# EAGLE board TINRS - Wobbler (pico)sch (EAGLE 7.7.0)
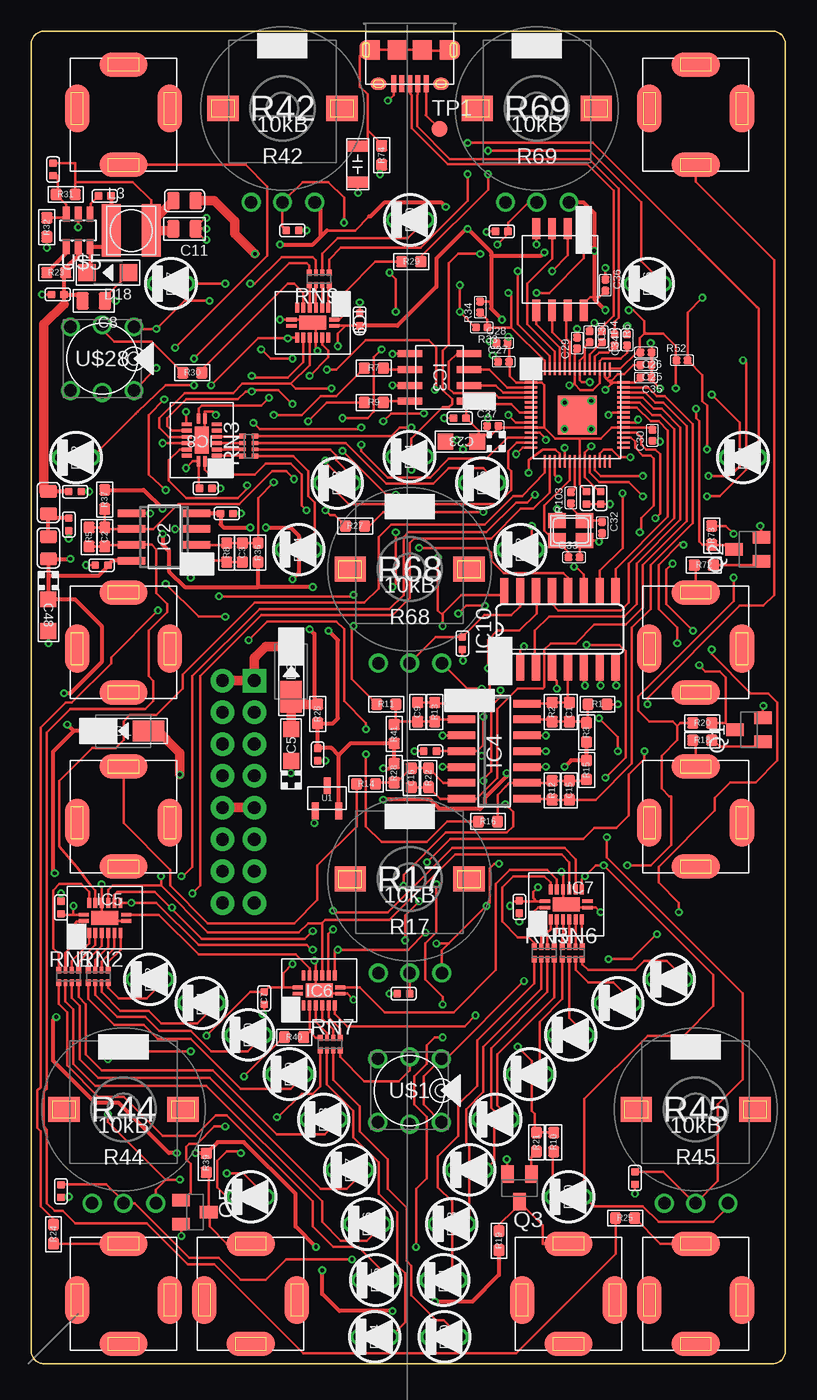
[diagram p5: board, top side]
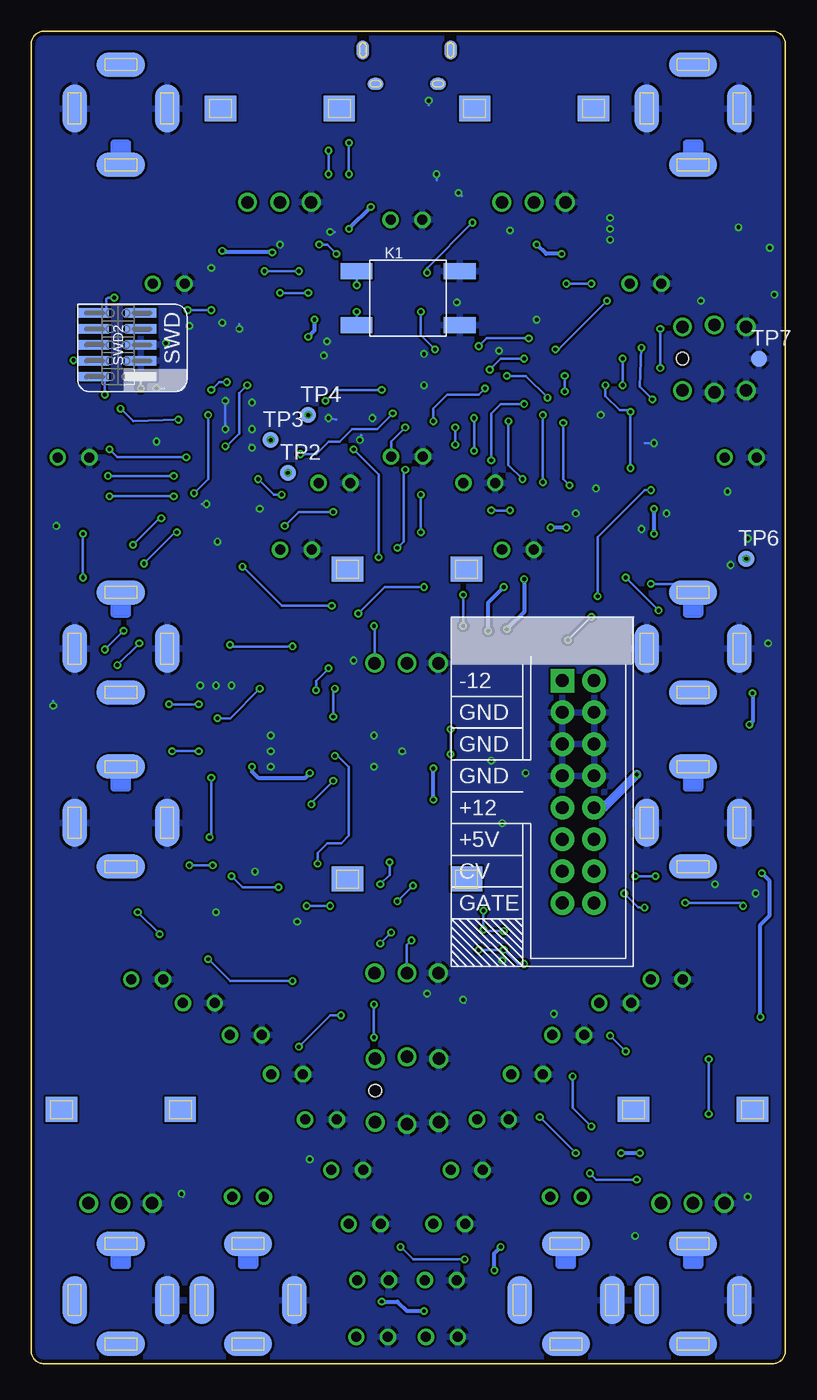
[diagram p6: board, bottom side, seen from below]

Size 60.25 x 106.5 mm. Coordinates in mm from the lower left corner, seen from the top.
Copper layers (1*16): Top 0.035mm / dielectric 1.5mm / Bottom 0.035mm
Design rules "dirt_cheap_dirty_boards.v1.1": minimum track width 6mil, minimum drill 12mil, track to track 6mil, track to pad 6mil, pad to pad 6mil, via to via 6mil, smd to smd 0mil, copper to edge 10mil, drill to drill 10mil, minimum pad ring 10mil, minimum via ring 6mil, stop-mask expansion 2mil, vias tented up to drill 25mil, thermal gap 10mil
Net classes: 0 default: width 0.203 mm, clearance 0.178 mm; 1 heavypower: width 0.305 mm; 2 mediumpower: width 0.254 mm; 3 groundplane: width 0.203 mm, clearance 0.203 mm; 4 returnground: width 0.356 mm; 5 reallyheav: width 0.762 mm

## Footprints (pad centres in the part's own frame; a part is rotated, then mirrored left to right if it is on the bottom)
C0603 = smd 0.889 x 0.889: 1 -0.762,0; 2 0.762,0
C0402 = smd 0.6 x 0.6: 1 -0.5,0; 2 0.5,0
CASE-A_3216 = smd 1.27 x 1.27: + -1.27,0; - 1.27,0
C0805 = smd 1.016 x 1.397: 1 -0.889,0; 2 0.889,0
C0402' = smd 0.635 x 0.635: 1 -0.445,0; 2 0.445,0
C3216 = smd 0.889 x 1.6: P$1 -1.448,0; P$2 1.448,0
DO-214AC = smd 2.5 x 1.7: 1 -2,0; 2 2,0
3MMLED = drill 0.8: + -1.27,0; - 1.27,0
SOD123 = smd 1.397 x 1.397: + -1.651,0; - 1.651,0
SO08 = smd 0.6 x 2.2: 1 -1.905,-2.6; 2 -0.635,-2.6; 3 0.635,-2.6; 4 1.905,-2.6; 5 1.905,2.6; 6 0.635,2.6; 7 -0.635,2.6; 8 -1.905,2.6
SOIC8-N_MC = smd 0.559 x 1.981: 1 -1.905,-2.362; 2 -0.635,-2.362; 3 0.635,-2.362; 4 1.905,-2.362; 5 1.905,2.362; 6 0.635,2.362; 7 -0.635,2.362; 8 -1.905,2.362
SO14 = smd 0.6 x 2.2: 1 -3.81,-2.6; 2 -2.54,-2.6; 3 -1.27,-2.6; 4 0,-2.6; 5 1.27,-2.6; 6 2.54,-2.6; 7 3.81,-2.6; 8 3.81,2.6; 9 2.54,2.6; 10 1.27,2.6; 11 0,2.6; 12 -1.27,2.6; 13 -2.54,2.6; 14 -3.81,2.6
QFN50P250X350X100-17N = smd 0.305 x 0.813: 1 -0.254,1.702; 8 -0.254,-1.702; 9 0.254,-1.702; 16 0.254,1.702 | smd 0.813 x 0.305: 2 -1.194,1.245; 3 -1.194,0.762; 4 -1.194,0.254; 5 -1.194,-0.254; 6 -1.194,-0.762; 7 -1.194,-1.245; 10 1.194,-1.245; 11 1.194,-0.762; 12 1.194,-0.254; 13 1.194,0.254; 14 1.194,0.762; 15 1.194,1.245 | smd 1.143 x 2.159: 17 0,0
SO16 = smd 0.66 x 2.032: 1 -4.445,-3.073; 2 -3.175,-3.073; 3 -1.905,-3.073; 4 -0.635,-3.073; 5 0.635,-3.073; 6 1.905,-3.073; 7 3.175,-3.073; 8 4.445,-3.073; 9 4.445,3.073; 10 3.175,3.073; 11 1.905,3.073; 12 0.635,3.073; 13 -0.635,3.073; 14 -1.905,3.073; 15 -3.175,3.073; 16 -4.445,3.073
C132563 = smd 0.4 x 1.35: 1 -1.3,4.15; 2 -0.65,4.15; 3 0,4.15; 4 0.65,4.15; 5 1.3,4.15 | smd 1.25 x 0.95 bottom: B@1 -2.5,4.15; B@3 2.5,4.15 | smd 1.25 x 0.95: B@2 -2.5,4.15; B@4 2.5,4.15 | smd 1.1 x 1.55: B@5 2.95,1.45; B@8 -2.95,1.45 | smd 1.5 x 1.55: B@6 1,1.45; B@7 -1,1.45 | smd 1 x 1.55: B@9 -3.5,1.45; B@12 3.5,1.45 | smd 1 x 1.55 bottom: B@10 -3.5,1.45; B@11 3.5,1.45
POWER_16_SHROUDED = drill 1.016 pad 1.88 square: 1 -8.89,-1.27 | drill 1.016 pad 1.88: 2 -8.89,1.27; 3 -6.35,-1.27; 4 -6.35,1.27; 5 -3.81,-1.27; 6 -3.81,1.27; 7 -1.27,-1.27; 8 -1.27,1.27; 9 1.27,-1.27; 10 1.27,1.27; 11 3.81,-1.27; 12 3.81,1.27; 13 6.35,-1.27; 14 6.35,1.27; 15 8.89,-1.27; 16 8.89,1.27
3.5MM-JACK-SWITCH-13MM-NOHOLES-TESTPAD = smd 1.95 x 3.85 bottom: RING_B@1 -3.7,0; SWITCH_B@1 3.7,0 | smd 1.95 x 3.85: RING_T@3 -3.7,0; SWITCH_T@3 3.7,0 | smd 3.85 x 1.95 bottom: SECOND_B@1 0,-3.5; TIP_B@1 0,4.5 | smd 3.85 x 1.95: SECOND_T@3 0,-3.5; TIP_T@3 0,4.5
4P-SMD-6.0X6.0X5.0H = smd 2.54 x 1.27: 0A -4.129,2.159; 0B 4.129,2.159; 1A -4.129,-2.159; 1B 4.129,-2.159
L0805 = smd 1.016 x 1.397: 1 -0.889,0; 2 0.889,0
L0420 = smd 1.5 x 4.2: 1 -1.6,0; 2 1.6,0
SOT23-BEC = smd 1 x 1.4: B -0.95,-1.1; C 0,1.1; E 0.95,-1.1
NX3225 = smd 1.4 x 1.2: 1 -1.1,-0.8; 2 1.1,-0.8; 3 1.1,0.8; 4 -1.1,0.8
R0603 = smd 0.889 x 0.889: 1 -0.762,0; 2 0.762,0
R0402 = smd 0.635 x 0.635: 1 -0.445,0; 2 0.445,0
ALPS_POT_SQUAREHOLES = drill 1: P$1 -2.5,-7.5; P$2 0,-7.5; P$3 2.58,-7.5 | smd 2.5 x 2: P$4 -4.75,0; P$5 4.75,0 | smd 2.5 x 2 bottom: P$6 -4.75,0; P$7 4.75,0
4X0402ARV341 = smd 0.4 x 0.5: 1 -0.8,-0.5; 4 0.8,-0.5; 5 0.8,0.5; 8 -0.8,0.5 | smd 0.3 x 0.5: 2 -0.25,-0.5; 3 0.25,-0.5; 6 0.25,0.5; 7 -0.25,0.5
M50-3600542 = smd 0.75 x 2.5: 1 -2.54,-1.81; 2 -2.54,2; 3 -1.27,-1.81; 4 -1.27,2; 5 0,-1.81; 6 0,2; 7 1.27,-1.81; 8 1.27,2; 9 2.54,-1.81; 10 2.54,2
B1,27 = smd 1.27 x 1.27: TP 0,0
SOT95P237X112-3N = smd 1.321 x 0.559: 1 -1.016,0.94; 2 -1.016,-0.94; 3 1.016,0
PB6149L = drill 1: 1 2.54,2.54; 2 2.54,-2.54; 3 -2.54,2.54; 4 -2.54,-2.54; LEDNEG 0,-2.7; LEDPOS 0,2.7 | hole 1: 2.54,0
QFN-56 = smd 3.1 x 3.1: GND 0,0 | smd 1 x 0.18: P$1 -3.7,2.6; P$2 -3.7,2.2; P$3 -3.7,1.8; P$4 -3.7,1.4; P$5 -3.7,1; P$6 -3.7,0.6; P$7 -3.7,0.2; P$8 -3.7,-0.2; P$9 -3.7,-0.6; P$10 -3.7,-1; P$11 -3.7,-1.4; P$12 -3.7,-1.8; P$13 -3.7,-2.2; P$14 -3.7,-2.6; P$29 3.7,-2.6; P$30 3.7,-2.2; P$31 3.7,-1.8; P$32 3.7,-1.4; P$33 3.7,-1; P$34 3.7,-0.6; P$35 3.7,-0.2; P$36 3.7,0.2; P$37 3.7,0.6; P$38 3.7,1; P$39 3.7,1.4; P$40 3.7,1.8; P$41 3.7,2.2; P$42 3.7,2.6 | smd 0.18 x 1: P$15 -2.6,-3.7; P$16 -2.2,-3.7; P$17 -1.8,-3.7; P$18 -1.4,-3.7; P$19 -1,-3.7; P$20 -0.6,-3.7; P$21 -0.2,-3.7; P$22 0.2,-3.7; P$23 0.6,-3.7; P$24 1,-3.7; P$25 1.4,-3.7; P$26 1.8,-3.7; P$27 2.2,-3.7; P$28 2.6,-3.7; P$43 2.6,3.7; P$44 2.2,3.7; P$45 1.8,3.7; P$46 1.4,3.7; P$47 1,3.7; P$48 0.6,3.7; P$49 0.2,3.7; P$50 -0.2,3.7; P$51 -0.6,3.7; P$52 -1,3.7; P$53 -1.4,3.7; P$54 -1.8,3.7; P$55 -2.2,3.7; P$56 -2.6,3.7
SOT23-6 = smd 0.55 x 1.2: 1 -0.95,-1.3; 2 0,-1.3; 3 0.95,-1.3; 4 0.95,1.3; 5 0.003,1.3; 6 -0.95,1.3
SOIC-8 = smd 0.635 x 1.7: 1 -1.905,-3.27; 2 -0.635,-3.27; 3 0.635,-3.27; 4 1.905,-3.27; 5 1.905,3.27; 6 0.635,3.27; 7 -0.635,3.27; 8 -1.905,3.27

## Placement (x,y rotation side)
C1  3.3nF  [C0603]  42.99,52.08 90 top
C2  3.3nF C0G  [C0603]  5.87,66.08 270 top
C3  3.3nF COG  [C0603]  16.87,64.83 270 top
C4  100nF  [C0402]  34.45,57.57 270 top
C5  10uF  [CASE-A_3216]  20.76,49.44 90 top
C6  100nF  [C0402]  22.89,48.69 90 top
C7  100nF  [C0402]  18.61,29.2 90 top
C8  10u  [C0805]  5,84.95 180 top
C9  3.3nF  [C0603]  30.87,52.08 90 top
C10  100nF  [C0402]  37.6,90.51 180 top
C11  22u  [C0805]  12.25,90.7 180 top
C14  100nF  [C0402]  2.37,36.45 270 top
C15  3.3nF  [C0603]  42.99,45.83 270 top
C16  3.3nF  [C0603]  30.37,46.83 270 top
C17  100nF  [C0402]  31.87,48.95 180 top
C18  100nF  [C0402]  5.62,63.83 0 top
C19  100nF  [C0402]  15.62,67.95 180 top
C20  100nF  [C0402]  39,36.5 90 top
C21  100nF  [C0402]  20.87,90.58 0 top
C22  100nF  [C0402]  13.94,69.97 180 top
C23  10uF  [CASE-A_3216]  34.37,73.7 180 top
C24  100nF  [C0402]  29.75,29.58 180 top
C25  100n  [C0402']  49.12,79.83 180 top
C26  100n  [C0402']  49.12,80.83 180 top
C27  100n  [C0402']  37.74,80.08 0 top
C28  100n  [C0402']  37.62,81.58 0 top
C29  100n  [C0402']  43.62,81.58 90 top
C30  100n  [C0402']  49.62,74.2 90 top
C31  100n  [C0402']  44.62,82.08 270 top
C32  27p  [C0402']  45.62,66.83 270 top
C33  27p  [C0402']  43.37,64.45 0 top
C34  1u  [C0402']  47.62,81.83 90 top
C35  100n  [C0402']  49.12,78.83 180 top
C36  100n  [C0402']  45.87,86.2 270 top
C37  100n  [C0402']  36.87,74.95 0 top
C38  100nF  [C0402]  26.25,83.45 270 top
C39  4.7n 100v  [C3216]  26.08,95.88 90 top
C40  100nF  [C0402]  48.24,14.83 270 top
C41  100nF  [C0402]  2.37,13.78 270 top
C42  10n  [C0402]  3,67.08 90 top
C43  100nF  [C0402]  2.12,85.45 0 top
C44  100nF  [C0402]  3.5,69.7 180 top
C45  100nF  [C0402]  5.87,93.33 180 top
C46  33p  [C0402]  1.75,95.45 270 top
C48  10uF  [CASE-A_3216]  1.37,59.83 270 top
C74  100n  [C0402]  44.37,69.2 90 top
C99  100n  [C0402]  45.49,69.2 270 top
C100  1u  [C0402]  34.24,75.58 180 top
D1  MRA4004T3G  [DO-214AC]  7.36,50.56 180 top
D2  MRA4004T3G  [DO-214AC]  20.76,55.31 90 top
D3  yellow  [3MMLED]  17.53,13.33 180 top
D4  yellow  [3MMLED]  35.01,15.48 180 top
D5  yellow  [3MMLED]  37.1,19.51 180 top
D6  yellow  [3MMLED]  39.82,23.14 180 top
D7  yellow  [3MMLED]  43.11,26.27 180 top
D8  yellow  [3MMLED]  46.86,28.82 180 top
D9  yellow  [3MMLED]  50.99,30.71 180 top
D10  yellow  [3MMLED]  33.02,2.14 180 top
D11  yellow  [3MMLED]  32.94,6.67 180 top
D12  yellow  [3MMLED]  39.09,65.06 180 top
D13  yellow  [3MMLED]  24.44,70.39 180 top
D14  yellow  [3MMLED]  21.37,65.06 180 top
D16  yellow  [3MMLED]  49.27,86.33 180 top
D17  yellow  [3MMLED]  11.17,86.33 180 top
D18  schottky  [SOD123]  6.12,87.2 180 top
D20  yellow  [3MMLED]  30.27,91.43 180 top
D21  yellow  [3MMLED]  56.87,72.43 180 top
D22  yellow  [3MMLED]  3.57,72.43 180 top
D24  yellow  [3MMLED]  27.44,2.14 180 top
D25  yellow  [3MMLED]  27.52,6.67 180 top
D26  yellow  [3MMLED]  26.85,11.16 180 top
D27  yellow  [3MMLED]  25.45,15.48 180 top
D28  yellow  [3MMLED]  23.36,19.51 180 top
D29  yellow  [3MMLED]  20.64,23.14 180 top
D30  yellow  [3MMLED]  17.35,26.27 180 top
D31  yellow  [3MMLED]  13.6,28.82 180 top
D32  yellow  [3MMLED]  9.47,30.71 180 top
D33  yellow  [3MMLED]  33.61,11.16 180 top
D34  yellow  [3MMLED]  30.23,72.5 180 top
D35  yellow  [3MMLED]  36.02,70.39 180 top
D40  yellow  [3MMLED]  42.93,13.33 180 top
IC2  TL072  [SO08]  10.62,66.08 90 top
IC3  MCP4822-E/SN  [SOIC8-N_MC]  32.62,78.83 90 top
IC4  MCP6004  [SO14]  36.99,48.95 270 top
IC5  74HC595BQ  [QFN50P250X350X100-17N]  5.88,35.63 90 top
IC6  74HC595BQ  [QFN50P250X350X100-17N]  23,29.83 90 top
IC7  74HC595BQ  [QFN50P250X350X100-17N]  42.74,36.7 90 top
IC8  74HC595BQ  [QFN50P250X350X100-17N]  13.62,73.83 180 top
IC9  74HC595BQ  [QFN50P250X350X100-17N]  22.5,83.2 270 top
IC10  4052D  [SO16]  42.24,58.7 0 top
J1  MICRO-USB-5P  [C132563]  30.25,106.45 180 top
J14  POWERSHROUDED  [POWER_16_SHROUDED]  16.55,45.71 270 bottom
JACK1  [3.5MM-JACK-SWITCH-13MM-NOHOLES-TESTPAD]  7.37,43.23 0 top
JACK2  [3.5MM-JACK-SWITCH-13MM-NOHOLES-TESTPAD]  7.37,57.15 0 top
JACK3  [3.5MM-JACK-SWITCH-13MM-NOHOLES-TESTPAD]  53.09,100.33 180 top
JACK4  [3.5MM-JACK-SWITCH-13MM-NOHOLES-TESTPAD]  53.09,43.23 0 top
JACK5  [3.5MM-JACK-SWITCH-13MM-NOHOLES-TESTPAD]  53.09,57.15 0 top
JACK6  [3.5MM-JACK-SWITCH-13MM-NOHOLES-TESTPAD]  7.37,100.33 180 top
JACK7  [3.5MM-JACK-SWITCH-13MM-NOHOLES-TESTPAD]  7.37,5.08 0 top
JACK8  [3.5MM-JACK-SWITCH-13MM-NOHOLES-TESTPAD]  53.09,5.08 0 top
JACK9  [3.5MM-JACK-SWITCH-13MM-NOHOLES-TESTPAD]  17.53,5.08 0 top
JACK10  [3.5MM-JACK-SWITCH-13MM-NOHOLES-TESTPAD]  42.93,5.08 0 top
K1  BUTTON-4P-3100010P1  [4P-SMD-6.0X6.0X5.0H]  30.14,85.16 0 bottom
L1  0.1uH C76737  [L0805]  1.37,65.2 90 top
L2  0.1uH C76737  [L0805]  1.37,68.83 90 top
L3  4.7uH  [L0420]  8,90.58 0 top
L4  0.1uH C76737  [L0805]  12.25,92.95 0 top
OUTLINE  EURORACK_PCB12HP  [EURORACK12HPPCB]  -0.25,0 0 top
Q1  MMBT3904  [SOT23-BEC]  57.35,50.66 90 top
Q2  MMBT3904  [SOT23-BEC]  57.24,65.09 90 top
Q3  MMBT3904  [SOT23-BEC]  39,14.04 180 top
Q4  12mhz  [NX3225]  43.12,66.58 180 top
Q5  MMBT3904  [SOT23-BEC]  13.08,12.11 270 top
R1  100k  [R0603]  45.24,52.7 0 top
R2  33k  [R0603]  41.62,52.08 270 top
R3  100k  [R0603]  44.37,50.45 270 top
R4  27  [R0402]  45.62,82.08 270 top
R5  187k 0.1%  [R0603]  4.62,66.08 90 top
R6  27  [R0402]  46.62,81.83 270 top
R7  38.3k 0.1%  [R0603]  27.37,79.58 0 top
R8  187k 0.1%  [R0603]  15.62,64.83 90 top
R9  38.3k 0.1%  [R0603]  27.37,76.83 0 top
R10  56  [R0603]  41.74,17.7 90 top
R11  100k  [R0603]  28.37,52.7 180 top
R12  33k  [R0603]  41.62,45.83 90 top
R13  33k  [R0603]  32.24,52.08 270 top
R14  100k  [R0603]  26.75,46.33 180 top
R15  100k  [R0603]  44.37,47.45 90 top
R16  100k  [R0603]  36.49,43.33 180 top
R17  10kB  [ALPS_POT_SQUAREHOLES]  30.23,38.73 0 top
R18  100k  [R0603]  53.62,49.83 0 top
R19  10k  [R0603]  37.37,9.83 270 top
R20  10k  [R0603]  53.62,51.2 180 top
R21  100k  [R0603]  40.37,17.7 270 top
R22  33k  [R0603]  31.75,46.83 90 top
R23  100k  [R0603]  2,87.2 0 top
R24  100  [R0603]  1.78,10.35 90 top
R25  100  [R0603]  47.45,11.64 180 top
R26  10k  [R0603]  22.88,51.94 270 top
R27  56  [R0603]  25.87,66.95 180 top
R28  100k  [R0603]  29,47.2 90 top
R29  56  [R0603]  30.37,88.08 180 top
R30  56  [R0603]  12.87,79.2 0 top
R31  49.9k  [R0603]  2.75,93.45 180 top
R32  16.2k  [R0603]  1.25,90.83 270 top
R33  1k  [R0402]  35.99,82.83 180 top
R34  10k DNP  [R0402]  35.87,84.45 90 top
R36  187k 0.1%  [R0603]  18.12,64.83 270 top
R37  187k 0.1%  [R0603]  5.87,69.08 90 top
R39  10k  [R0603]  13.99,16.05 90 top
R40  100k  [R0603]  21,26.08 180 top
R41  100k  [R0603]  29,50.33 270 top
R42  10kB  [ALPS_POT_SQUAREHOLES]  20.07,100.33 0 top
R44  10kB  [ALPS_POT_SQUAREHOLES]  7.37,20.32 0 top
R45  10kB  [ALPS_POT_SQUAREHOLES]  53.09,20.32 0 top
R52  10k  [R0402]  51.99,80.2 0 top
R68  10kB  [ALPS_POT_SQUAREHOLES]  30.23,63.5 0 top
R69  10kB  [ALPS_POT_SQUAREHOLES]  40.39,100.33 0 top
R72  100k  [R0603]  53.74,63.83 0 top
R73  10k  [R0603]  54.37,66.2 90 top
R74  1M  [R0603]  28,96.58 90 top
R103  1k  [R0402]  43.12,69.2 90 top
RN1  56  [4X0402ARV341]  2.98,30.96 180 top
RN2  56  [4X0402ARV341]  5.37,30.96 180 top
RN3  56  [4X0402ARV341]  17.37,73.33 270 top
RN5  56  [4X0402ARV341]  40.99,32.83 180 top
RN6  56  [4X0402ARV341]  43.24,32.83 180 top
RN7  56  [4X0402ARV341]  23.88,25.55 180 top
RN9  56  [4X0402ARV341]  23,86.7 0 top
SWD2  CORTEX_SWD  [M50-3600542]  53.3,81.44 90 bottom
TP1  PTR1B1,27  [B1,27]  32.62,98.7 0 top
TP2  PTR1B1,27  [B1,27]  39.74,71.2 0 bottom
TP3  PTR1B1,27  [B1,27]  41.12,73.83 0 bottom
TP4  PTR1B1,27  [B1,27]  38.12,75.83 0 bottom
TP6  PTR1B1,27  [B1,27]  3.12,64.33 0 bottom
TP7  PTR1B1,27  [B1,27]  2.12,80.33 0 bottom
U1  LM4040DIM3-5.0  [SOT95P237X112-3N]  23.64,45.19 90 top
U$1  SWITCH_W_LED_PB6149L-X-102YELLOW  [PB6149L]  30.23,21.83 0 top
U$2  RP2040  [QFN-56]  43.62,75.83 0 top
U$5  BL9342  [SOT23-6]  3.75,90.58 180 top
U$25  W25Q256JVEIQTR  [SOIC-8]  42.24,87.45 180 top
U$28  SWITCH_W_LED_PB6149L-X-102YELLOW  [PB6149L]  5.67,80.33 0 top

## Tracks (layer width: path | path; a pad name or v marks a point on that pad's centre or on a via)
1.1V  (via drill 0.3)
  Top 0.203: C34.1 47.62,80.83 47.12,80.33 45.62,80.33 45.42,80.13 U$2.P$45 45.42,78.38 44.87,77.83 43.87,77.83 43.42,78.28 43.42,78.38 | C29.1 43.42,80.94 U$2.P$50 43.42,78.62 43.42,78.38 | C99.1 45.37,69.7 44.22,70.85 U$2.P$23 44.22,72.81 v44.74,73.33 | v42.99,78.2 43.24,78.2 43.42,78.38
  Bottom 0.203: v44.74,73.33 44.62,73.33 43.62,74.33 43.62,77.58 v42.99,78.2
3.3V  (via drill 0.3)
  Top 0.203: U$2.P$48 44.22,80.58 | 44.22,80.58 44.22,81.23 C31.2 | 44.22,80.58 43.82,80.18 U$2.P$49 43.82,78.63 43.99,78.45 v44.62,78.45 | U$2.P$44 45.82,78.88 45.99,78.7 | 45.99,78.7 46.12,78.58 | 46.12,78.58 46.37,78.58 46.87,79.08 47.37,79.08 48.12,79.83 C25.2 | C35.2 48.28,78.43 U$2.P$42 46.27,78.43 | 46.27,78.43 46.12,78.58 | 45.99,78.7 46.22,78.93 U$2.P$43 47.07,79.53 48.37,80.83 C26.2 48.62,80.88 48.62,81.95 48.99,82.33 49.12,82.33 | v45.87,77.83 46.37,78.33 46.27,78.43 | C30.2 49.49,74.83 U$2.P$33 46.37,74.83 45.49,73.95 43.74,73.95 | C14.2 2.44,35.88 IC5.16 3.44,35.88 3.37,35.95 v3.37,36.58 | v51.49,77.95 51.49,80.26 | 49.12,82.33 50.49,82.33 51.49,81.33 51.49,80.26 | C22.2 13.37,70.04 IC8.16 12.92,72.13 v12.37,71.58 | IC5.10 7.13,36.84 7.87,36.83 v8,36.83 10,36.83 13.37,33.45 22,33.45 22.37,33.08 v22.5,33.08 | C74.2 43.82,70.25 U$2.P$22 43.82,73.88 43.74,73.95 | v40.49,38.08 40.12,37.7 40.12,37.2 40.37,36.96 IC7.16 39.04,36.96 C20.2 38.95,36.95 38.58,36.95 v38.24,36.58 | IC7.10 43.99,38.7 v44.24,38.95 45.12,39.83 v45.74,39.83 54.49,31.08 54.49,28.58 52.12,26.2 49.24,26.2 44.2,21.16 D40.+ 44.95,12.58 48.87,12.58 50.12,11.33 54.49,11.33 55.67,12.5 R45.P$3 | 44.99,85.26 44.68,85.26 44.24,84.83 44.24,84.28 U$25.8 | v47.74,84.2 48.12,84.2 48.99,83.33 48.99,82.45 49.12,82.33 | IC6.10 24.24,33.08 v24.5,33.08 30.12,33.08 v31.5,34.45 | IC3.1 34.74,76.69 C100.1 35.74,74.58 35.74,73.97 C23.+ | C23.+ 36.27,74.2 36.74,74.2 37.31,74.78 C37.2 37.69,74.83 U$2.P$10 40.99,74.83 | C28.2 38.19,81.45 C27.2 38.24,80.03 38.24,78.95 38.77,78.43 U$2.P$1 40.77,78.43 40.99,78.2 40.99,74.83
  Top 0.203: v20.87,31.95 20.12,31.2 20.12,30.08 IC6.16 18.99,30.08 C7.2 17.5,29.7 v14,26.2 | R17.P$3 32.81,33.02 33.37,33.58 | 33.37,33.58 v36.37,36.58 36.62,36.83 36.62,39.58 36.99,39.95 v37.37,39.95 | IC9.16 25.12,82.95 | 25.12,82.95 C38.2 | R44.P$3 9.95,13.91 10.75,14.7 | 10.75,14.7 v11.87,14.7 | v15.62,15.2 16.93,15.2 D3.+ | v12.37,76.08 12.37,75.13 IC8.10 | 44.99,85.26 44.99,85.2 | 44.99,85.26 45.37,85.26 C36.2 | 51.49,80.26 R52.1 | v32.37,33.58 33.37,33.58 | IC9.10 20.55,82.01 v20.5,81.95 18.12,81.95 v14.37,78.2 | v24.5,81.33 24.5,82.33 25.12,82.95 | R20.2 51.87,51.2 51.62,50.95 | v47.62,39.83 49.49,39.83 51.12,41.45 51.12,45.33 50.99,45.33 50.37,45.95 50.37,48.58 51.62,49.83 51.62,50.95 | v32.87,58.95 32.87,59.83 | 32.87,59.83 32.87,59.95 34.37,61.45 37.48,61.45 IC10.16 | C17.1 IC4.4 35.62,48.95 | 35.62,48.95 36.12,49.45 v36.12,51.7 | v35.99,53.95 34.85,53.95 R68.P$3 | 40.99,74.83 41.87,73.95 43.74,73.95 | R73.2 55.48,66.97 v56.12,66.33 | v56.12,62.83 56.12,60.95 48.49,53.33 48.49,52.2 49.37,51.33 51.24,51.33 51.62,50.95 | C23.+ 35.24,73.83 v34.49,73.08 | v32.49,64.45 32.49,60.2 32.87,59.83 | v12.75,24.95 6.75,24.95 v6.12,24.33 | v6.12,19.95 6.12,19.33 10.75,14.7 | 23.62,90.58 25.87,90.58 27,91.7 | 35.62,48.95 v35.99,48.58 | R34.2 36.55,84.9 36.74,84.7
  Top 0.305: 18.11,88.69 v17.87,88.7 | v19.87,89.45 22.5,89.45 23.12,90.08 | 23.12,90.08 23.12,92.36 R42.P$3 | 23.12,90.08 23.62,90.58 | 27,91.7 27.12,91.7 28.25,92.83 32.74,92.83 v33.12,92.45 | C38.2 29.25,82.95 32.37,86.08 32.37,88.33 34.74,90.7 v34.87,90.7 36.74,88.83 36.74,88.58 | 36.74,88.58 36.74,84.7 36.74,84.33 v37.62,83.45 | v38.12,82.08 38.12,81.63 C28.2 | 36.74,88.58 40.74,88.58 v40.99,88.83 | v44.99,88.95 44.99,89.33 | R69.P$3 44.12,92.83 44.99,91.95 v44.99,88.95 | v44.99,88.95 44.99,85.2 44.99,85.08 v45.87,84.2
  Top 0.762: L4.2 14.62,92.95 16.25,91.33 16.25,90.33 v17.87,88.7
  Bottom 0.203: v44.62,78.45 45.24,78.45 v45.87,77.83 | SWD2.1 v51.49,77.95 | v40.49,38.08 43.37,38.08 v44.24,38.95 | v45.87,84.2 v47.74,84.2 | v24.5,33.08 v22.5,33.08 21.37,31.95 v20.87,31.95 | v8,36.83 3.62,36.83 v3.37,36.58 | v36.37,36.58 v38.24,36.58 | v11.87,14.7 15.12,14.7 v15.62,15.2 | v12.37,71.58 v12.37,76.08 12.5,76.2 13.25,76.2 14.37,77.33 v14.37,78.2 | v31.5,34.45 v32.37,33.58 | v20.5,81.95 23.87,81.95 v24.5,81.33 | v47.62,39.83 v45.74,39.83 | R68.P$3 32.81,58.89 v32.87,58.95 | v36.12,51.7 36.12,53.83 v35.99,53.95 | v56.12,66.33 v56.12,62.83 | v34.49,73.08 32.49,71.08 v32.49,64.45 | v14,26.2 v12.75,24.95 | v6.12,24.33 v6.12,19.95 | v35.99,48.58 35.74,48.58 34.87,47.7 34.87,42.2 35.49,41.58 36.62,41.58 37.37,40.83 v37.37,39.95
  Bottom 0.305: v17.87,88.7 19.12,88.7 v19.87,89.45 | v33.12,92.45 v34.87,90.7 | v37.62,83.45 37.62,82.58 v38.12,82.08 | v40.99,88.83 44.87,88.83 v44.99,88.95
12V  (via drill 0.3)
  Top 0.305: IC2.8 6.46,64.17 C18.2 6.12,63.7 5.37,62.95 1.37,62.95 | 1.37,62.95 L1.1 3.11,64.32 TP6.TP | 1.37,62.95 C48.+ 3.48,61.1 5.62,58.95 5.62,56.08 3.12,53.58 v2.62,53.58 | v32.24,4.95 35.24,4.95 37.37,7.08 R19.2 | v28.87,4.2 24.62,4.2 23.25,5.58 v23.25,7.45 | v22.75,9.33 21.12,10.95 21.12,13.58 17,17.7 14.88,17.7 R39.2 13.14,16.81 v13.12,16.83 | D1.2 3.39,50.56 | v2.87,51.08 3.39,50.56 | v11.62,16.83 11,16.83 7,20.83 5.12,20.83 1.75,24.2 1.75,27.45 v2,27.7 | v1.87,39.2 1.75,39.33 1.75,48.92 3.39,50.56
  Bottom 0.305: v32.24,4.95 31,4.95 30.25,4.2 v28.87,4.2 | v23.25,7.45 23.25,8.83 v22.75,9.33 | v2.62,53.58 2.62,51.33 v2.87,51.08 | v13.12,16.83 v11.62,16.83 | v2,27.7 2,35.08 1.25,35.83 1.25,38.58 v1.87,39.2
  other vias: 3.12,64.33
-12V  (via drill 0.3)
  Top 0.305: IC2.4 15.09,67.98 C19.2 15.12,67.08 15.37,66.83 v17.5,66.83 | v18.75,66.83 20.75,66.83 21.37,66.2 21.37,63.2 v20.87,62.7 | v22.25,58.7 22.62,58.33 22.62,52.96 R26.1
  Top 0.762: C5.- D2.1 21.37,52.7 R26.1
  Bottom 0.305: v17.5,66.83 v18.75,66.83 | v20.87,62.7 20.87,60.08 v22.25,58.7
ADC0
  Top 0.203: U$2.P$38 48.62,76.83 49.62,75.83 50.24,75.83 51.37,74.7 51.37,67.58 47.74,63.95 47.74,60.83 47.12,60.2 42.12,60.2 41.61,60.71 IC10.13
ADC1
  Top 0.203: U$2.P$39 48.84,77.23 49.74,76.33 50.37,76.33 51.87,74.83 51.87,67.45 48.37,63.95 48.37,60.7 47.37,59.7 41.37,59.7 40.24,58.58 40.24,55.73 IC10.3
ADC_FREQ
  Top 0.203: U$2.P$40 49.07,77.63 49.87,76.83 50.49,76.83 52.37,74.95 52.37,67.33 48.87,63.83 48.87,60.45 47.49,59.08 44.99,59.08 43.49,57.58 41.49,57.58 40.99,57.08 40.99,54.08 40.87,53.95 38.87,53.95 37.24,52.33 37.24,46.83 35.56,45.14 IC4.7 32.67,45.14 R22.1 C16.2
ADC_MOD
  Top 0.203: IC4.14 41.54,52.77 R2.1 C1.2 42.88,52.96 IC10.5
ADC_NORMAL  (via drill 0.3)
  Top 0.203: C41.1 2.41,14.33 6,14.33 7.37,12.95 R44.P$2 8.26,12.82 12.62,8.45 15,8.45 16.75,6.7 18.75,6.7 20.37,8.33 v25.62,8.33 | v30.75,9.33 30.75,13.95 31.62,14.83 31.62,19.7 30.62,20.7 30.62,22.95 31.62,23.95 31.62,25.45 32.24,26.08 v32.87,26.08 | v48.99,48.95 48.99,48.33 47.74,47.08 47.74,43.83 46.74,42.83 44.99,42.83 44.12,41.95 33.49,41.95 v31.62,40.08 | v32.37,38.33 32.37,34.45 31.5,33.58 31.5,30.7 32.87,29.33 v32.87,28.7 | v45.37,51.58 46.87,50.08 v46.87,48.95 | v41.99,53.95 41.99,54.58 41.74,54.83 41.74,55.5 IC10.4
  Bottom 0.203: v25.62,8.33 29.75,8.33 v30.75,9.33 | v46.87,48.95 v48.99,48.95 | v31.62,40.08 31.62,39.08 v32.37,38.33 | v32.87,28.7 v32.87,26.08 | v45.37,51.58 44.37,51.58 v41.99,53.95
ADC_PHASE
  Top 0.203: C9.2 R13.1 32.32,52.77 IC4.1 36.18,52.77 36.62,53.2 36.62,54.33 37.74,55.45 37.74,55.58 37.75,55.58 IC10.1
ADC_PHASED  (via drill 0.3)
  Top 0.203: C40.1 50.49,15.33 53,12.82 R45.P$2 54.87,14.6 54.87,20.7 56.87,22.7 56.87,29.58 45.99,40.45 v45.99,42.08 | IC10.2 39.07,57.03 v39.37,57.33 | v44.37,57.45 46.99,57.45 47.49,56.95 47.49,48.45 v45.87,46.83
  Bottom 0.203: v39.37,57.33 44.24,57.33 v44.37,57.45 | v45.87,46.83 45.87,42.2 v45.99,42.08
ADC_SHAPE
  Top 0.203: U$2.P$41 49.29,78.03 49.99,77.33 50.62,77.33 52.87,75.08 52.87,67.2 49.49,63.83 49.49,60.33 47.99,58.83 47.99,47.95 45.11,45.07 C15.2 R12.1 41.54,45.14 IC4.8
ARM1_1
  Top 0.203: IC6.4 22.74,27.33 23.62,26.45 RN7.3
ARM2_1
  Top 0.203: IC6.5 23.25,27.58 24.12,26.7 RN7.2
BOOTSEL_BUT  (via drill 0.3)
  Top 0.203: R33.2 35.49,82.83 v34.24,84.08 v34.24,86.2
  Bottom 0.203: v34.24,84.08 34.24,83.03 K1.1A | v34.24,86.2 34.24,87.3 K1.0A
CLOCK  (via drill 0.3)
  Top 0.203: IC5.11 6.65,37.48 6.87,37.7 9.87,37.7 11.12,36.45 | 11.12,36.45 13.62,33.95 21.87,33.95 v22.5,34.58 | v24.12,34.7 23.75,34.33 23.75,31.04 IC6.11 | IC7.11 43.51,40.32 42.62,41.2 33.62,41.2 28.5,36.08 24.25,36.08 v24.12,36.2 | 11.12,36.45 v11.25,36.45 | v12.87,37.58 13.5,38.2 13.5,54.95 18.37,59.83 28.87,59.83 30.25,61.2 30.25,65.58 30.62,65.95 36.74,65.95 39.12,68.33 40.12,68.33 41.42,69.63 U$2.P$16
  Bottom 0.203: v22.5,34.58 24,34.58 v24.12,34.7 v24.12,36.2 | v11.25,36.45 11.75,36.45 v12.87,37.58
CLOCK_2  (via drill 0.3)
  Top 0.203: IC9.11 21.73,80.07 20.5,78.83 17.75,78.83 v17.62,78.95 | IC8.11 12.41,74.58 11.25,74.58 10.87,74.95 10.87,75.58 12.37,77.08 16.5,77.08 17.12,77.7 v17.62,77.7 17.75,77.83 19.75,77.83 v20.87,76.7 | v23.5,72.2 23.5,72.08 24.5,71.08 24.5,69.58 25.37,68.7 37.24,68.7 38.37,69.83 38.37,71.33 38.12,71.58 38.12,72.95 38.8,73.63 U$2.P$13
  Bottom 0.203: v17.62,78.95 v17.62,77.7 | v20.87,76.7 22.75,76.7 23.5,75.95 v23.5,72.2
DACCS
  Top 0.203: U$2.P$3 37.7,77.63 37.13,78.19 IC3.2
DACSCK
  Top 0.203: U$2.P$2 38.05,78.03 36.61,79.47 IC3.3
DACSDI
  Top 0.203: IC3.4 34.02,80.73 33.37,80.08 33.37,77.95 33.74,77.58 36.99,77.58 37.34,77.23 U$2.P$4
FASTMODE_BUT  (via drill 0.3)
  Top 0.203: U$28.2 v10,79.58 | U$28.1 8.38,82.7 v10,82.7 12.25,84.95 v14.25,84.95 | U$2.P$7 39.05,76.03 38.37,76.7 36.99,76.7 v36.74,76.95 | v32.24,77.83 32.37,77.95 32.37,81.2 31.75,81.83 26.75,81.83 24.37,79.45 v23.62,79.45 | v20.87,80.33 19.12,80.33 v18.37,81.08
  Bottom 0.203: v10,79.58 v10,82.7 | v36.74,76.95 35.87,77.83 v32.24,77.83 | v23.62,79.45 22.75,80.33 v20.87,80.33 | v18.37,81.08 18.12,81.08 v14.25,84.95
FASTMODE_LED
  Top 0.203: R30.2 13.77,79.07 13.77,79.6 20.5,86.33 21,86.33 21.75,85.58 21.75,84.41 IC9.6
GND  (via drill 0.3)
  Top 0.203: C39.P$1 26.08,93.62 v26.12,93.58 | R74.1 28,95.2 v27.87,95.08 | C29.2 v43.62,82.7 | v50.24,77.95 49.56,78.63 C35.1 C25.1 C26.1 49.56,81.51 v49.49,81.58 | C34.2 v47.62,82.95 | C14.1 v2.37,37.58 | C40.2 v48.24,13.58 | C41.2 2.95,13.28 v3,13.33 | IC5.8 6.14,35.38 IC5.17 5.63,35.88 IC5.13 5.63,38.32 v5.62,38.33 | C48.- v1.37,57.58 | IC3.7 29.01,78.19 v28.87,78.2 | IC3.5 28.9,80.73 v28.87,80.7 | C10.2 36.42,90.51 v36.37,90.45 | U$25.4 40.34,89.48 v40.37,89.45 | C21.2 v22,90.58 | IC10.8 46.69,54.26 v46.74,54.2 | IC10.7 45.42,54.28 v45.49,54.2 | IC10.6 44.15,54.3 v44.24,54.2 | Q1.E 58.45,52.53 v58.49,52.58 | Q2.E 58.34,66.86 v58.24,66.95 | C44.1 v4.62,69.7 | C42.1 v3,65.95 | IC2.5 9.46,67.98 v9.5,67.95 | C18.1 v4.37,63.83 | IC2.3 11.5,66.72 v11.5,66.7 | C19.1 v16.75,67.95 | C22.1 15.1,69.97 v15.12,69.95 | v10.5,73.58 10.87,73.58 IC8.13 13.37,73.58 IC8.17 13.87,74.08 IC8.8 13.87,76.08 13.88,76.08 14.5,76.08 v14.75,75.83 | C43.1 v0.87,85.45 | R32.2 1.23,89.57 v1.25,89.2 | U$5.2 v3.75,90.83 | v22.87,80.95 22.75,81.21 IC9.13 22.75,82.95 IC9.17 22.24,83.46 IC9.8 v19.87,83.46 v19.87,83.45 | U$2.GND v42.62,76.83 | U$2.GND 43.62,75.7 v42.62,74.7 | U$2.GND v44.74,76.95 | v44.74,74.7 44.37,74.7 | v46.24,68.7 C99.2 C74.1 | C32.2 45.62,65.95 v45.37,65.7 45.29,65.78 Q4.4 43.81,65.37 C33.2 | Q4.2 42.02,68.31 v41.99,68.33 | C30.1 50.19,73.76 v50.24,73.7 | C6.1 23.48,48.19 v23.5,48.2 | C5.+ 20.76,47.22 v20.75,47.2 | U1.1 22.7,43.28 v22.62,43.2 | v45.49,36.08 45.12,36.45 IC7.8 43,36.45 IC7.17 42.49,36.96 IC7.13 42.49,39.08 v42.37,39.33 | C20.1 39,35.46 38.99,35.45 v38.99,35.33 | v25.75,29.08 25.25,29.58 IC6.8 23.25,29.58 IC6.17 22.74,30.08 IC6.13 22.74,31.95 v22.62,32.2
  Top 0.203: C24.2 v28.62,29.58 | C100.2 v32.99,75.58 | C23.- 33.37,74.08 33.49,73.83 v33.99,73.83 | C37.1 v36.49,75.58 | C28.1 36.74,81.58 v36.62,81.7 | C27.1 37.24,80.08 36.87,80.45 v36.87,80.58 | Q3.E 38.05,16.27 v37.99,16.33 | C7.1 18.61,28.08 18.62,28.08 v18.5,27.95 | Q5.E v11.98,10.22 v12,10.2 | C4.2 34.45,56.25 v34.49,56.2 | C36.1 v45.87,87.58 | U$2.P$19 v42.62,73.2 | C38.1 v26.25,84.83 | C17.2 v30.62,48.95 | IC4.3 32.98,50.23 v32.87,50.2 | IC4.5 32.89,47.68 v32.87,47.7 | IC4.12 41.1,50.23 v41.12,50.2 | IC4.11 v41.12,48.95 | IC4.10 41.1,47.68 v41.12,47.7 | v6.75,84.95 C8.1 6.25,85.32 6.25,85.58 7.77,87.11 D18.+ | C11.1 v14,90.7 | C11.1 13.13,90.84 13.87,91.58 v14,91.58 | C11.1 13.13,90.57 13.87,89.83 v14,89.83 | C31.1 44.62,82.83 v44.99,83.2 | J1.5 28.95,101.41 v28.5,100.95
  Bottom 0.203: v26.12,93.58 25.87,93.33 | v27.87,95.08 27.87,94.58 | v43.62,82.7 43.62,83.08 | v50.24,77.95 49.62,77.95 | v49.49,81.58 49.49,81.7 | v47.62,82.95 47.62,83.08 | v48.24,13.58 48.24,13.45 48.12,13.33 | v3,13.33 3.12,13.33 3.25,13.2 | v1.37,57.58 1.37,57.33 | v28.87,80.7 28.75,80.7 | v36.37,90.45 35.99,90.45 | v40.37,89.45 40.37,89.2 | v22,90.58 22.12,90.58 | v46.74,54.2 46.62,54.08 | v45.49,54.2 45.49,54.08 | v44.24,54.2 44.24,54.08 | v58.49,52.58 58.49,52.95 | v58.24,66.95 58.24,67.08 | v4.62,69.7 4.62,69.83 | v3,65.95 3,65.7 | v9.5,67.95 9.62,68.08 | v4.37,63.83 4.25,63.83 | v11.5,66.7 11.62,66.7 | v16.75,67.95 16.87,67.95 | v15.12,69.95 15.37,69.95 | v10.5,73.58 11.25,73.58 | v0.87,85.45 0.87,85.2 | v1.25,89.2 1.12,88.95 | v3.75,90.83 3.75,90.7 | v19.87,83.45 19.75,83.45 | v42.62,76.83 42.62,76.58 | v42.62,74.7 42.62,74.95 | v44.74,76.95 v44.74,74.7 | v46.24,68.7 46.62,68.7 | v45.37,65.7 45.37,65.45 | v41.99,68.33 41.99,68.45 | v50.24,73.7 50.37,73.7 | v23.5,48.2 23.62,48.2 | v20.75,47.2 20.75,46.95 | v22.62,43.2 22.62,42.95 | v45.49,36.08 45.49,35.95 | v42.37,39.33 42.49,39.2 | v38.99,35.33 38.99,35.2 | v25.75,29.08 25.75,28.95 25.62,28.83 | v5.62,38.33 5.62,38.45 | v33.99,73.83 33.87,74.2 | v36.49,75.58 35.87,75.45 | v36.62,81.7 36.37,81.7 | v36.87,80.58 36.74,80.58 | v37.99,16.33 38.12,16.45 | v18.5,27.95 18.37,27.95 | v12,10.2 11.87,10.08 | v34.49,56.2 34.49,55.95 | v45.87,87.58 45.87,87.83 | v42.62,73.2 42.74,73.45 | v26.25,84.83 26.25,85.08 | v30.62,48.95 30.5,48.95 30.37,48.83 | v32.87,50.2 32.99,50.08 | v32.87,47.7 32.62,47.7 | v41.12,50.2 41.24,50.2 | v41.12,48.95 40.99,48.95 | v41.12,47.7 41.24,47.7 41.37,47.58 | v14,90.7 14.12,90.7 | v14,91.58 14.12,91.58
  Bottom 0.203: v14,89.83 14.12,89.83 | v44.99,83.2 44.99,83.45 | v28.5,100.95 28.5,100.58
  pour Bottom: -0.89,106.68 -5.33,-2.54 63.25,-1.91 63.25,109.86
KNOB_FREQ  (via drill 0.3)
  Top 0.203: C24.1 30.25,31.22 R17.P$2 | v29.87,33.83 29.87,35.83 v31,36.95 | v29.75,38.2 29.75,39.08 33.12,42.45 37.99,42.45 38.49,42.95 38.49,44.08 v37.87,44.7 | v36.12,46.58 36.12,46.7 36.74,47.33 36.74,52.58 37.49,53.33 v37.49,53.83 | v36.49,55.58 36.49,57.83 37.24,58.58 38.99,58.58 40.37,59.95 40.37,61.75 IC10.14
  Bottom 0.203: R17.P$2 30.23,33.47 v29.87,33.83 | v31,36.95 v29.75,38.2 | v37.87,44.7 37.87,44.83 v36.12,46.58 | v37.49,53.83 37.49,54.58 v36.49,55.58
KNOB_MOD  (via drill 0.3)
  Top 0.203: R69.P$2 39.74,92.83 38.12,91.2 38.12,90.53 C10.1 38.1,90.31 v37.24,89.45 | IC10.12 42.88,62.82 42.49,63.2 37.74,63.2 36.74,64.2 36.74,64.83 36.37,65.2 v31,65.2 | v35.87,88.7 34.12,88.7 33.37,87.95 33.37,81.45 32.87,80.95 32.87,77.83 33.62,77.08 33.62,76.7 33.37,76.45 32.87,76.45 30.37,73.95 v30.37,71.45
  Bottom 0.203: v37.24,89.45 36.62,89.45 v35.87,88.7 | v31,65.2 30.5,65.7 30.5,71.33 v30.37,71.45
KNOB_PHASE  (via drill 0.3)
  Top 0.203: C21.1 20.07,90.88 R42.P$2 21.7,94.45 23.75,94.45 25,93.2 v25,91.2 | IC10.11 44.15,63.08 43.52,63.7 v43.37,63.7 | v24.87,72.95 28.37,69.45 v29.12,69.45 | v24.87,75.58 26.87,75.58 27.37,76.08 27.37,80.45 v28,81.08 | v29.12,84.08 29.12,86.7 v28.62,87.2 | v29.12,66.45 29.12,62.33 v28.87,62.08 | v34.12,59.95 34.74,60.58 v36.24,60.58
  Bottom 0.203: v24.87,72.95 v24.87,75.58 | v28,81.08 29.12,82.2 v29.12,84.08 | v28.62,87.2 28.62,87.58 v25,91.2 | v29.12,66.45 v29.12,69.45 | v28.87,62.08 32,62.08 v34.12,59.95 | v36.24,60.58 40.24,60.58 v43.37,63.7
KNOB_SHAPE
  Top 0.203: R68.P$2 32.3,58.07 C4.1 36.2,59.83 38.37,59.83 39.07,60.53 IC10.15
LATCH  (via drill 0.3)
  Top 0.203: IC5.12 6.14,37.85 6.5,38.2 10.37,38.2 | 10.37,38.2 14.12,34.45 21.37,34.45 22.12,35.2 23.25,35.2 | IC6.12 23.25,35.2 | 23.25,35.2 23.25,35.21 23.5,35.45 28.62,35.45 33.87,40.7 42.37,40.7 42.99,40.08 IC7.12 | 10.37,38.2 v10.37,38.95 | v12,38.95 12.12,38.95 12.87,39.7 12.87,54.95 18.25,60.33 28.62,60.33 29.75,61.45 29.75,66.08 30.12,66.45 36.37,66.45 38.74,68.83 39.62,68.83 v40.24,69.45 | 41.99,70.83 v42.12,70.7 41.82,71 U$2.P$17
  Bottom 0.203: v10.37,38.95 v12,38.95 | v40.24,69.45 40.87,69.45 v42.12,70.7
LATCH_2  (via drill 0.3)
  Top 0.203: 20.75,78.33 22.24,79.83 IC9.12 | 20.75,78.33 16.87,78.33 16.12,77.58 12.25,77.58 10.25,75.58 10.25,74.83 11,74.08 IC8.12 | v31.37,75.95 28.75,75.95 v28.12,75.33 | v24,77.95 21.12,77.95 20.75,78.33 | U$2.P$14 39.27,73.23 v38.74,72.7
  Bottom 0.203: v28.12,75.33 28.12,76.33 27,77.45 24.5,77.45 v24,77.95 | v38.74,72.7 37.49,72.7 36.49,73.7 35.62,73.7 34.62,74.7 32.62,74.7 v31.37,75.95
MEM_CLK
  Top 0.203: U$25.6 41.61,82.47 42.62,81.45 U$2.P$52
MEM_CS  (via drill 0.3)
  Top 0.203: U$2.P$56 41.02,80.18 38.37,82.83 | 38.37,82.83 38.37,85.33 v38.12,85.58 | v40.37,85.58 41.37,85.58 44.15,88.36 U$25.1 | 38.37,82.83 R33.1 36.44,83.44 R34.1
  Bottom 0.203: v38.12,85.58 v40.37,85.58
MEM_IO0
  Top 0.203: U$2.P$53 42.22,81.23 40.34,83.11 U$25.5
MEM_IO1  (via drill 0.3)
  Top 0.203: U$2.P$55 41.42,80.53 38.87,83.08 v38.87,87.33 | v41.62,87.33 42.88,88.59 U$25.2
  Bottom 0.203: v41.62,87.33 v38.87,87.33
MEM_IO2
  Top 0.203: U$2.P$54 41.82,80.88 39.62,83.08 39.62,86.33 41.62,88.33 41.62,90.75 U$25.3
MEM_IO3
  Top 0.203: U$25.7 43.02,84.05 42.77,83.66 42.74,83.58 42.74,81.95 43.02,81.68 U$2.P$51
MUX_A  (via drill 0.3)
  Top 0.203: IC10.10 45.42,63.38 47.24,65.2 v47.24,69.58 | U$2.P$36 46.45,76.03 46.12,75.7 v46.12,75.83
  Bottom 0.203: v46.12,75.83 46.12,70.7 v47.24,69.58
MUX_B
  Top 0.203: U$2.P$37 48.39,76.43 49.49,75.33 50.12,75.33 50.87,74.58 50.87,67.7 46.69,63.52 IC10.9
N$1
  Top 0.203: IC5.15 4.64,37.68 4,38.33 2.25,38.33 1.75,37.83 1.75,33.2 2.18,32.77 RN1.4
N$2
  Top 0.203: U$2.P$20 43.02,70.6 40.99,68.58 40.99,66.58 41.49,66.08 41.59,66.2 Q4.3 42.93,64.87 C33.1
N$3  (via drill 0.3)
  Top 0.203: R16.2 33.24,43.33 31.62,41.7 28,41.7 26.75,42.95 v26.75,48.7 | v26.75,50.7 26.75,51.2 25,52.95 25,58.7 24.37,59.33 18.87,59.33 v17.37,57.83 | v15.5,59.7 13.37,59.7 v10.75,62.33
  Bottom 0.203: v26.75,48.7 v26.75,50.7 | v17.37,57.83 v15.5,59.7 | v10.75,62.33 8.05,62.33 JACK2.TIP_T@3
N$4
  Top 0.203: R15.1 44.27,46.59 C15.1 R12.2 41.44,46.41 IC4.9 38.2,46.41 38.12,46.33 37.93,46.14 37.26,45.47 R16.1
N$5
  Top 0.203: IC3.8 28.23,76.92 R9.2
N$6  (via drill 0.3)
  Top 0.203: JACK3.TIP_T@3 53.09,94.48 59.37,88.2 59.37,61.45 58.49,60.58 56.62,60.58 49.24,53.2 v49.24,52.7 | R1.2 v46.87,52.7
  Bottom 0.203: v46.87,52.7 v49.24,52.7
N$7
  Top 0.203: IC3.6 28.25,79.47 R7.2
N$8
  Top 0.203: IC4.13 41.44,51.49 R2.2 C1.1 44.27,51.32 R3.1 44.48,51.33 R1.1
N$9  (via drill 0.3)
  Top 0.203: C2.1 6,66.72 IC2.6 9.75,66.7 11.75,68.7 16.62,68.7 19.25,71.33 20.37,71.33 v21,70.7 | C2.1 R5.2 | C2.1 R37.1 | R9.1 23.62,76.83 v22.12,75.33
  Bottom 0.203: v22.12,75.33 22.12,71.83 v21,70.7
N$10  (via drill 0.3)
  Top 0.203: IC2.2 15.47,65.44 R8.2 C3.1 R36.1 18.12,69.2 v19.37,70.45 | v19.37,75.83 21.62,75.83 23.12,77.33 24.37,77.33 R7.1
  Bottom 0.203: v19.37,70.45 v19.37,75.83
N$11  (via drill 0.3)
  Top 0.203: JACK6.TIP_T@3 17.12,95.83 18.87,94.08 18.87,88.58 v11.5,81.2 | v10.62,77.08 9.37,75.83 9.37,71.08 v10.75,69.83 | v15,61.33 25.62,61.33 v25.75,61.45 | R11.2 25.62,54.7 25.62,58.7 v25.75,58.95
  Bottom 0.203: v11.5,81.2 11.62,78.08 v10.62,77.08 | v10.75,69.83 11.25,69.83 15,66.08 v15,61.33 | v25.75,58.95 v25.75,61.45
N$12
  Top 0.203: IC4.2 32.42,51.49 R13.2 C9.1 29.22,51.32 R41.1 29.13,51.33 R11.1
N$13  (via drill 0.3)
  Top 0.762: J14.10 J14.9 | D1.1 9.5,50.83 9.87,50.83 11.87,48.83 v11.87,47.08
  Bottom 0.762: J14.10 14.51,44.44 v11.87,47.08
N$14
  Top 0.203: RN6.6 42.99,27.65 D7.+
N$15
  Top 0.203: R18.2 54.49,49.83 54.99,49.33 58.07,49.33 Q1.B
N$16
  Top 0.203: JACK4.TIP_T@3 53.09,49.6 R18.1
N$17
  Top 0.203: C32.1 45.52,67.38 Q4.1 43.12,68.48 R103.1
N$18
  Top 0.203: U$2.P$47 44.62,80.63 R4.2
N$19
  Top 0.203: IC5.1 4.14,35.33 3.62,35.33 3.5,35.2 3.5,34.7 3.48,33.59 2.73,32.84 RN1.3
N$20
  Top 0.203: JACK8.TIP_T@3 50.26,9.58 R25.1
N$21
  Top 0.203: JACK7.TIP_T@3 R24.1
N$22
  Top 0.203: IC5.2 4.64,33.6 3.23,32.19 RN1.2
N$23
  Top 0.203: D40.- 41.66,16.86 R10.1
N$24
  Top 0.203: U$2.P$46 45.02,80.48 45.37,80.83 46.12,80.83 R6.2
N$25
  Top 0.203: Q3.B 39.95,16.52 R21.2
N$26
  Top 0.203: IC5.3 5.12,33.46 3.78,32.11 RN1.1
N$27  (via drill 0.3)
  Top 0.203: D3.- 15.61,13.33 14.87,14.08 14.87,16.2 15.62,16.95 16.62,16.95 v16.75,16.83 | v19.62,19.7 19.75,19.7 21.62,21.58 22.5,21.58 23.07,22.16 RN7.5
  Bottom 0.203: v16.75,16.83 v19.62,19.7
N$28
  Top 0.203: RN2.5 4.56,29.14 6.62,27.08 9,27.08 10.12,25.95 12.75,25.95 16.75,21.95 20.72,21.95 D29.+
N$29
  Top 0.203: Q3.C | JACK10.TIP_T@3 40.88,9.58 40.88,11.06 Q3.C | R19.1 37.37,11.08 38.62,12.33 38.62,12.56 Q3.C
N$30
  Top 0.203: IC5.4 5.63,33.39 4.56,32.33 RN2.4
N$31
  Top 0.203: IC5.5 6.14,33.31 5.12,32.29 RN2.3
N$32
  Top 0.203: RN1.8 3.78,29.3 4.37,28.7 4.37,24.7 5.62,23.45 14.5,23.45 19.62,18.33 23.45,18.33 D28.+
N$33
  Top 0.203: JACK1.TIP_T@3 7.37,43.2 11.12,39.45 11.12,38.2 14.12,35.2 21,35.2 22.87,37.08 22.87,39.83 26,42.95 26,46.32 R14.2
N$34
  Top 0.203: IC4.6 32.92,46.41 R22.2 C16.1 29.22,46.44 R28.1 27.62,46.44 R14.1
N$35
  Top 0.203: IC5.6 6.65,33.18 5.62,32.15 RN2.2
N$36
  Top 0.203: IC5.7 7.13,33.07 6.17,32.11 RN2.1
N$37
  Top 0.203: IC8.2 16.82,72.58 RN3.4
N$38
  Top 0.203: RN6.1 44.04,34.16 43.99,34.21 IC7.7
N$39
  Top 0.203: IC7.6 43.51,34.22 43.49,34.2 RN6.2
N$40
  Top 0.203: IC7.5 43,34.21 42.99,34.2 RN6.3
N$41
  Top 0.203: RN7.7 24.12,22.7 26.25,20.58 26.25,18.58 28.5,16.33 28.5,13.95 30,12.45 30,8.2 30.37,7.83 30.37,5.45 32.37,3.45 32.97,3.45 D10.+
N$42
  Top 0.203: RN3.6 23.9,73.08 23.9,73.05 24.37,72.58 24.37,72.2 25.62,70.95 D13.+
N$43
  Top 0.203: IC7.4 42.49,34.21 | 42.49,34.21 42.49,34.2 | RN6.4 42.45,34.16 42.49,34.21
N$44
  Top 0.203: R72.2 58.03,63.83 Q2.B
N$45
  Top 0.203: JACK5.TIP_T@3 53.09,63.72 R72.1
N$46
  Top 0.203: RN6.5 42.45,29.16 40.62,27.33 40.62,23.61 D6.+
N$47
  Top 0.203: RN5.8 41.79,29.25 37.24,24.7 37.24,20.63 D5.+
N$48
  Top 0.203: RN5.7 41.24,29.7 36.74,25.2 36.74,20.45 36.99,20.2 36.99,16.2 D4.+
N$49
  Top 0.203: RN6.7 43.49,31.45 44.49,30.45 46.5,30.45 D8.+
N$50
  Top 0.203: RN6.8 44.04,31.91 44.49,31.45 48.24,31.45 48.99,32.2 50.76,32.2 D9.+
N$51
  Top 0.203: RN7.8 24.68,24.52 26.62,22.58 29.37,22.58 30.25,23.45 30.25,24.52 U$1.LEDPOS
N$52
  Top 0.203: RN5.5 40.2,30.41 35.62,25.83 35.62,22.2 34.12,20.7 34.12,18.2 32.49,16.58 32.49,14.08 33.62,12.95 33.62,7.26 D11.+
N$53
  Top 0.203: IC7.3 41.98,34.44 41.79,34.25 RN5.1
N$54
  Top 0.203: IC7.2 41.5,34.71 41.24,34.45 RN5.2
N$55
  Top 0.203: RN5.3 40.74,35.33 40.24,35.83 40.24,36.2 40.49,36.45 IC7.1
N$56
  Top 0.203: RN5.4 40.2,33.63 39.74,34.08 38.87,34.08 37.62,35.33 37.62,38.08 38.49,38.95 40.99,38.95 41.49,38.45 IC7.15
N$57
  Top 0.203: IC8.3 16.86,73.07 RN3.3
N$58
  Top 0.203: D14.+ 22.64,68.81 22.12,69.33 22.12,71.33 20.92,72.53 RN3.5
N$59
  Top 0.203: IC8.4 RN3.2
N$60  (via drill 0.3)
  Top 0.203: Q5.B 12.11,13.06 12.75,13.7 12.75,15.95 12.37,16.33 12.37,17.33 12.62,17.58 13.25,17.58 14.62,18.95 v15.5,18.95 | R40.2 20.12,26.08 v17,22.95
  Bottom 0.203: v17,22.95 17,20.45 v15.5,18.95
N$61
  Top 0.203: JACK9.TIP_T@3 15.62,9.58 14.25,10.95 14.25,12.05 Q5.C 14.18,15.09 R39.1
N$62
  Top 0.203: IC8.5 16.82,74.08 RN3.1
N$63  (via drill 0.3)
  Top 0.203: v22,68.2 21.62,68.58 21.62,71.08 20.75,71.95 18.75,71.95 17.87,71.08 14.25,71.08 13.87,71.45 IC8.1 | v23.5,68.2 23.87,67.83 24.23,67.83 R27.2
  Bottom 0.203: v22,68.2 v23.5,68.2
N$64
  Top 0.762: J14.2 J14.1 17.82,56.4 17.87,56.45 18,56.58 18.73,57.31 D2.2
N$65  (via drill 0.3)
  Top 0.203: R27.1 27,66.95 28.12,68.08 v36.12,68.08 | v39.99,66.95 39.99,65.43 D12.+
  Bottom 0.203: v36.12,68.08 38.87,68.08 v39.99,66.95
N$66  (via drill 0.3)
  Top 0.203: RN3.8 28.75,74.13 29.45,74.83 v30.37,74.83
  Bottom 0.203: D34.+ 31.5,73.7 v30.37,74.83
N$67
  Top 0.203: RN3.7 25.12,73.58 28.37,70.33 32.12,70.33 33.37,71.58 36.1,71.58 D35.+
N$68
  Top 0.203: IC9.5 22.24,86.16 RN9.1
N$69
  Top 0.203: 26.87,98.58 26.87,101.45 26.25,102.08 26.25,104.5 J1.B@11 | 26.87,98.58 26.87,97.58 26.62,97.33 C39.P$2 | R74.2 28,97.45 26.87,98.58 | J1.B@5 J1.B@6 31.2,105 31.25,104.95 33.49,104.95
N$70
  Top 0.305: L1.2 L2.1 1.73,67.58 C42.2
N$71
  Top 0.203: U$28.LEDPOS 5.67,82.66 6.62,81.7 9.61,81.7 R30.1
N$72
  Top 0.203: RN9.6 23.25,88.7 24.5,89.95 30.07,89.95 D20.+
N$73
  Top 0.203: RN2.6 5.12,29.46 6.87,27.7 9.12,27.7 10.25,26.58 12.75,26.58 14.37,24.95 17.31,24.95 D30.+
N$74
  Top 0.203: RN2.7 5.62,29.71 7.12,28.2 9.37,28.2 10.37,27.2 13.25,27.2 D31.+
N$75
  Top 0.203: RN2.8 6.17,30.03 7,29.2 9.24,29.2 D32.+
N$76
  Top 0.203: RN7.6 23.62,22.33 25.75,20.2 25.75,18.08 27.75,16.08 27.75,13.58 29.25,12.08 29.25,7.83 29.87,7.2 29.87,3.29 D24.+
N$77
  Top 0.203: RN1.7 3.23,29.22 3.87,28.58 3.87,24.33 5.37,22.83 14.25,22.83 23.12,13.95 25.2,13.95 D27.+
N$78
  Top 0.203: RN1.6 2.73,28.97 3.37,28.33 3.37,23.95 5.12,22.2 14,22.2 23.25,12.95 23.25,11.33 24.75,9.83 26.79,9.83 D26.+
N$79
  Top 0.203: RN1.5 2.18,28.77 2.87,28.08 2.87,23.83 5.37,21.33 7.37,21.33 10.5,18.2 13.12,18.2 14.75,19.83 15.62,19.83 22.5,12.95 22.5,10.95 24.12,9.33 26.14,9.33 D25.+
N$80
  Top 0.203: RN5.6 40.74,29.95 36.12,25.33 36.12,21.7 34.74,20.33 34.74,17.7 34.99,17.45 34.99,11.28 D33.+
N$81
  Top 0.203: TP1.TP 31.53,99.8 31.55,99.81 J1.1
N$82  (via drill 0.3)
  Top 0.203: U$2.P$18 42.22,72.73 41.87,73.08 40.87,73.08 39.74,72.2 TP2.TP
  other vias: 39.74,71.2
N$83  (via drill 0.3)
  Top 0.203: R29.1 31.13,88.47 36.49,93.83 v36.49,95.08 | v36.49,96.95 44.62,96.95 48.74,92.83 48.74,88.12 D16.+
  Bottom 0.203: v36.49,95.08 v36.49,96.95
N$84  (via drill 0.3)
  Top 0.203: RN9.5 23.8,88.25 24.75,89.2 31.12,89.2 34.87,92.95 v34.87,95.08 | v34.87,97.58 44.87,97.58 57.99,84.45 | D21.+ 58.14,84.31 57.99,84.45 | 53.37,89.08 53.35,89.08 57.98,84.45 57.99,84.45
  Bottom 0.203: v34.87,95.08 v34.87,97.58
N$85  (via drill 0.3)
  Top 0.203: RN9.7 22.75,88.2 22.5,88.45 20,88.45 17.87,86.33 v17.5,86.33 | v15.5,86.33 D17.+
  Bottom 0.203: v17.5,86.33 v15.5,86.33
N$86  (via drill 0.3)
  Top 0.203: U$2.P$9 38.72,75.23 TP4.TP
  Bottom 0.203: TP4.TP 38.49,75.83
  other vias: 38.12,75.83
N$87
  Top 0.203: U$2.P$21 43.42,69.95 R103.2
N$88  (via drill 0.3)
  Top 0.203: RN9.8 22.2,87.75 22,87.95 21.25,87.95 20.62,87.95 v13,80.33 | v13,78.2 10.75,78.2 8.5,76.08 8.37,75.95 D22.+
  Bottom 0.203: v13,80.33 v13,78.2
N$89
  Top 0.203: IC9.4 RN9.2
N$90
  Top 0.203: IC9.3 23.26,86.19 RN9.3
N$91
  Top 0.203: IC9.2 23.74,86.15 RN9.4
N$92
  Top 0.203: IC9.1 24.62,83.46 25.12,83.95 25.12,85.7 27.5,88.08 R29.2
N$93
  Top 0.305: C44.2 1,69.7 0.87,69.58 1.23,69.58 L2.2 | 2.62,84.7 C43.2 | U$5.5 3.75,88.58 2.76,87.59 R23.2 2.62,87.07 C43.2 | C43.2 3.61,85.45 C8.2
  Top 0.762: 1,69.7 1,83.08 2.62,84.7
N$94  (via drill 0.3)
  Top 0.203: IC9.14 23.26,81.44 23.75,80.95 23.75,80.45 v22.25,78.95 | IC8.9 13.37,76.33 13.62,76.58 18.37,76.58 v19,77.2
  Bottom 0.203: v19,77.2 20.75,78.95 v22.25,78.95
N$95
  Top 0.203: U$5.1 4.7,91.63 4.75,92.08 4.75,92.7 C45.2
N$96
  Top 0.305: D18.- 4.7,87.43 U$5.6 6.32,89.28 L3.1 6.37,90.61 C45.1
N$97
  Top 0.203: C46.2 2.12,94.95 2.12,93.59 R31.2 2.79,92.64 U$5.3 2.51,91.59 R32.1
N$98
  Top 0.203: 10.87,90.58 L3.2 9.6,90.76 9.6,92.98 8.12,94.45 3.64,94.45 3.51,94.32 | 11,90.58 11.23,90.58 C11.2 | R31.1 3.51,94.32 | 3.51,94.32 3.51,95.95 C46.1
  Top 0.762: 9.6,90.76 9.6,91.19 L4.1 | 9.5,90.58 10.87,90.58 11,90.58 11.25,90.58
N$99
  Top 0.305: U$5.4 2.79,88.77 R23.1
N$100  (via drill 0.3)
  Top 0.203: U$2.P$11 40.64,74.43 41.12,73.95 TP3.TP
  Bottom 0.203: 41.12,73.7 TP3.TP
  other vias: 41.12,73.83
NORMALOUT  (via drill 0.3)
  Top 0.203: C3.2 R8.1 15.51,64.17 IC2.1 13.12,64.07 13.12,63.2 v12.75,62.83 | R24.2 1.78,11.55 0.75,12.58 0.75,18.58 0.5,18.83 0.5,21.83 0.75,22.08 0.75,50.83 2.75,52.83 3.25,52.83 6.37,55.95 6.37,56.45 v10.12,60.2
  Bottom 0.203: v12.75,62.83 v10.12,60.2
OUT_LFOCYCLEMID  (via drill 0.3)
  Top 0.203: R10.2 R21.1 40.24,18.59 40.24,19.95 39.99,20.2 39.99,24.2 v38.87,25.33 | IC6.7 24.24,27.96 25.25,26.95 34.62,26.95 v35.49,27.83
  Bottom 0.203: v38.87,25.33 36.37,27.83 v35.49,27.83
OUT_LFOCYCLESTART
  Top 0.203: IC6.3 22.23,26.56 | 22.23,26.56 R40.1 | RN7.4 22.74,26.05 22.23,26.56
PHASEDOUT
  Top 0.203: R5.1 C2.2 6,65.44 IC2.7 9.62,65.45 10,65.08 10,61.58 10.87,60.7 10.87,60.08 9.37,58.58 9.37,54.95 9.75,54.58 9.75,52.95 9.12,52.33 3.12,52.33 1.25,50.45 1.25,21.95 1,21.7 1,18.95 1.25,18.7 1.25,12.83 1.87,12.2 2.5,12.2 3.5,11.2 9.25,11.2 12.5,7.95 14.62,7.95 21.75,0.83 38.74,0.83 46.68,8.77 R25.2
REF_-5V  (via drill 0.3)
  Top 0.305: U1.2 24.57,48.62 | 24.57,48.62 24,49.2 22.9,49.2 C6.2 R26.2 24.09,51.18 24.5,51.58 24.5,57.83 v23.75,58.58 | 24.57,48.62 24.57,48.66 25.48,49.57 R41.2 R28.2 28.61,47.58 v28.12,47.58 | v22.5,62.08 18.12,62.08 | 18.12,62.08 R36.2 | R37.2 8.98,69.84 v10.5,68.33 | v10.5,66.33 10.5,65.45 11,64.95 11,63.33 12.25,62.08 18.12,62.08 | R3.2 R15.2 43.13,48.22 v42.62,47.7 | v37.99,47.2 37.99,46.95 36.24,45.2 36.24,44.7 35.87,44.33 32.62,44.33 31.87,45.08 v28.12,45.08
  Bottom 0.305: v23.75,58.58 23.75,60.83 v22.5,62.08 | v10.5,68.33 v10.5,66.33 | v42.62,47.7 42.62,47.33 42.12,46.83 38.37,46.83 v37.99,47.2 | v28.12,45.08 v28.12,47.58
RESET_PATTERN  (via drill 0.3)
  Top 0.203: R20.1 55.49,51.2 | Q1.C 55.96,50.95 55.74,50.95 55.49,51.2 | U$2.P$32 48.39,74.43 48.74,74.08 48.74,73.45 49.12,73.08 49.87,73.08 50.24,72.7 50.24,67.95 v49.87,67.58 | v52.12,65.45 51.87,65.58 50.12,63.83 50.12,60.33 51.62,58.83 v51.62,57.58 | v53.37,55.83 53.87,55.33 54.99,55.33 55.49,54.83 55.49,51.2
  Bottom 0.203: v49.87,67.58 49.99,67.58 v52.12,65.45 | v51.62,57.58 v53.37,55.83
RESET_PATTERN_BUT  (via drill 0.3)
  Top 0.203: U$1.2 32.77,19.3 31.37,20.7 31.37,22.97 U$1.1 33.16,24.37 v39.37,30.58 | U$2.P$31 47.92,74.03 48.24,73.7 48.24,73.2 48.87,72.58 49.49,72.58 49.74,72.33 49.74,68.58 48.74,67.58 48.74,66.58 v48.62,66.45 | v51.24,63.95 50.74,63.45 50.74,60.7 v52.87,58.58 | v46.12,32.33 47.99,32.33 v49.99,34.33 | v51.74,36.08 51.74,36.83 50.12,38.45 50.12,39.7 54.62,44.2 54.62,45.2 55.87,46.45 57.87,46.45 59.62,48.2 59.62,52.83 58.87,53.58 57.49,53.58 54.37,56.7 v54.37,57.08
  Bottom 0.203: v48.62,66.45 48.74,66.45 v51.24,63.95 | v39.37,30.58 44.37,30.58 v46.12,32.33 | v49.99,34.33 v51.74,36.08 | v54.37,57.08 v52.87,58.58
RUN  (via drill 0.3)
  Top 0.203: v53.99,73.08 53.99,76.58 53.62,76.95 53.62,79.03 R52.2 52.44,84.03 v53.62,85.2 | U$2.P$26 45.42,72.75 45.74,73.08 46.37,73.08 46.99,72.45 v47.87,72.45
  Bottom 0.203: SWD2.10 55.2,84.08 54.24,84.08 54.24,85.08 54.12,85.2 v53.62,85.2 | v47.87,72.45 53.37,72.45 v53.99,73.08
SHIFTER1TO2
  Top 0.203: IC5.9 10.19,35.88 13.37,32.7 21.12,32.7 22.25,31.58 22.25,31.04 IC6.14
SHIFTERS
  Top 0.203: IC5.14 5.12,37.83 4.75,38.2 3.62,39.7 2.25,41.33 2.25,46.58 4.87,49.2 6.75,49.2 7.37,49.83 7.37,51.33 7.87,51.83 10,51.83 12.12,53.95 12.12,55.08 17.87,60.83 26.62,60.83 27.75,61.95 27.75,66.08 28.75,67.08 36.24,67.08 38.49,69.33 39.24,69.33 41.02,71.23 U$2.P$15
SHIFTERS2TO3
  Top 0.203: IC6.9 26.25,30.08 28.25,28.08 33.74,28.08 37.12,31.45 37.12,38.33 38.24,39.45 41.24,39.45 41.98,38.72 IC7.14
SHIFTERS_2  (via drill 0.3)
  Top 0.203: v26.37,73.45 26.37,72.95 28.5,70.83 31.87,70.83 33.37,72.33 36.37,72.33 38.07,74.03 U$2.P$12 | v26.37,74.83 26.25,74.7 18.25,74.7 v17.75,75.2 | IC8.14 12.41,73.08 11.87,73.08 11,72.2 11,70.58 12.37,69.2 16.5,69.2 17.25,69.95 v17.25,70.2
  Bottom 0.203: v26.37,73.45 v26.37,74.83 | v17.75,75.2 17.75,70.7 v17.25,70.2
SWCLK  (via drill 0.3)
  Top 0.203: U$2.P$24 44.62,71.2 45.37,70.45 47.74,70.45 v48.87,69.33 | v53.99,69.33 54.99,69.33 57.12,71.45 57.12,79.95 v56.87,80.2
  Bottom 0.203: v56.87,80.2 55.34,80.2 SWD2.4 | v48.87,69.33 v53.99,69.33
SWDIO  (via drill 0.3)
  Top 0.203: U$2.P$25 45.02,71.43 45.49,70.95 v48.87,70.95 | v54.12,70.95 55.74,70.95 56.62,71.7 56.62,75.2 v54.37,77.45
  Bottom 0.203: 55.37,78.83 SWD2.2 55.24,78.83 54.37,78.83 v54.37,77.45 | v48.87,70.95 v54.12,70.95
SYNC_LFO  (via drill 0.3)
  Top 0.203: 56.02,65.2 Q2.C 55.78,65.44 R73.1 54.36,65.45 53.62,65.45 53.37,65.7 53.37,75.33 53.12,75.58 v53.12,76.33 | U$2.P$34 48.39,75.23 v48.49,75.45
  Bottom 0.203: v48.49,75.45 52.12,75.33 v53.12,76.33
TRIGGERBUTTON
  Top 0.203: IC6.6 23.76,27.69 24.68,26.77 RN7.1
USB_N
  Top 0.203: R6.1 46.62,83.29 46.95,83.62 46.95,93.91 44.58,96.28 33.45,96.28 30.82,98.91 30.82,101.41 30.87,101.45 30.87,102.28 J1.2
USB_P
  Top 0.203: R4.1 45.62,82.87 46.54,83.79 46.54,93.75 44.41,95.88 33.29,95.88 30.42,98.75 30.42,101.41 30.25,101.58 J1.3

## Text on the board
tNames: U$1